# EAGLE design pureDuino (EAGLE 6.5.0)
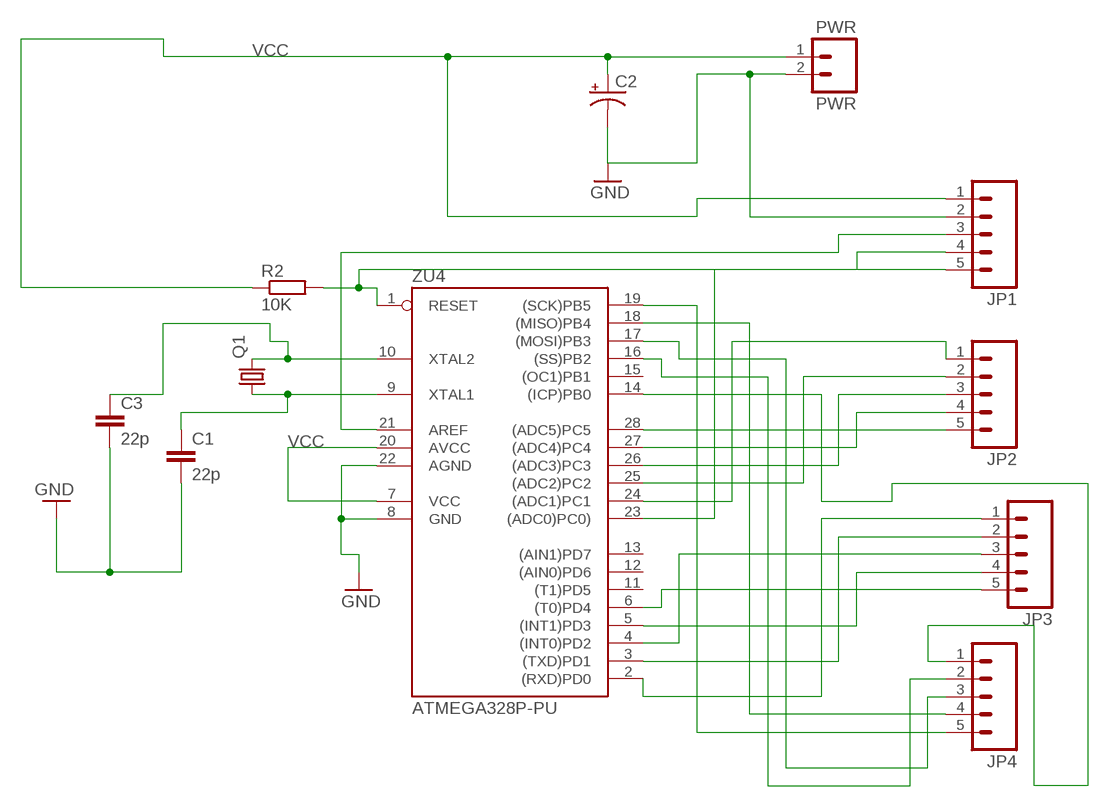
[diagram p0: schematic, sheet 1]

## Parts
C1  22p  C-EU050-025X075  [C050-025X075]
C2  CAP_POLPTH1  [CPOL-RADIAL-100UF-25V]
C3  22p  C-EU050-025X075  [C050-025X075]
JP1  M05PTH  [1X05]
JP2  M05PTH  [1X05]
JP3  M05PTH  [1X05]
JP4  M05PTH  [1X05]
PWR  PWR  M02PTH  [1X02]
Q1  CRYSTALHC49S  [HC49/S]
R2  10K  R-EU_0207/7  [0207/7]
ZU4  ATMEGA328P-PU  [DIL28-3]

## Nets
GND [gnd]: C1.2 C2.2(-) C3.2 JP1.2 PWR.2 ZU4.8(GND) ZU4.22(AGND)
N$1: JP1.3 ZU4.21(AREF)
N$2: JP1.5 ZU4.23((ADC0)PC0))
N$3: JP1.4 R2.2 ZU4.1(RESET)
N$4: C1.1 Q1.1 ZU4.9(XTAL1)
N$5: JP2.1 ZU4.24((ADC1)PC1)
N$6: JP2.2 ZU4.25((ADC2)PC2)
N$7: JP2.3 ZU4.26((ADC3)PC3)
N$8: JP2.4 ZU4.27((ADC4)PC4)
N$9: JP2.5 ZU4.28((ADC5)PC5)
N$10: JP4.5 ZU4.19((SCK)PB5)
N$11: JP3.1 ZU4.2((RXD)PD0)
N$12: JP3.2 ZU4.3((TXD)PD1)
N$13: JP3.3 ZU4.4((INT0)PD2)
N$14: JP3.4 ZU4.5((INT1)PD3)
N$15: JP3.5 ZU4.6((T0)PD4)
N$16: JP4.4 ZU4.18((MISO)PB4)
N$17: JP4.3 ZU4.17((MOSI)PB3)
N$18: JP4.2 ZU4.16((SS)PB2)
N$19: JP4.1 ZU4.14((ICP)PB0)
VCC [usbvcc]: C2.1(+) JP1.1 PWR.1 R2.1 ZU4.7(VCC) ZU4.20(AVCC)
XTAL2: C3.1 Q1.2 ZU4.10(XTAL2)
Unconnected: ZU4.11((T1)PD5) ZU4.12((AIN0)PD6) ZU4.13((AIN1)PD7) ZU4.15((OC1)PB1)

## Library data of the parts
C1 C3 = resistor:C-EU: CAPACITOR, European symbol
C2 = SparkFun-Passives:CAP_POL: Capacitor Polarized These are standard SMD and PTH capacitors. Normally 10uF, 47uF, and 100uF in electrolytic and tantalum varieties. Always verify the external diameter of the through hole cap, it varies with capacity, voltage, and manufacturer. The EIA devices should be standard.
JP1-JP4 = SparkFun-Connectors:M05: Header 5 Standard 5-pin 0.1" header. Use with straight break away headers (SKU : PRT-00116), right angle break away headers (PRT-00553), swiss pins (PRT-00743), machine pins (PRT-00117), and female headers (PRT-00115). Molex polarized connector foot print use with SKU : PRT-08230 with associated crimp pins and housings.
PWR = SparkFun-Connectors:M02: Standard 2-pin 0.1" header. Use with - straight break away headers ( PRT-00116) - right angle break away headers (PRT-00553) - swiss pins (PRT-00743) - machine pins (PRT-00117) - female headers (PRT-00115) Molex polarized connector foot print use with: PRT-08233 with associated crimp pins and housings. 2.54_SCREWTERM for use with PRT-10571. 3.5mm Screw Terminal footprints for PRT-08084 5mm Screw Terminal footprints for use with PRT-08433
Q1 = crystal:CRYSTAL: CRYSTAL; OC_FARNELL: 1667008; OC_NEWARK: unknown
R2 = resistor:R-EU_: RESISTOR, European symbol
ZU4 = SmartPrj:ATMEGA328P-: MICROCONTROLLER 4 Kbytes FLASH 128 bytes SRAM 256 bytes EEPROM UART 6-channel 10 bit ADC

## Net classes
0 default: width 0.152 mm, clearance 0.152 mm
1 power: width 0.61 mm, drill 0.61 mm, clearance 0.254 mm
2 gnd: width 0.203 mm, drill 0.559 mm, clearance 0.152 mm
3 usbvcc: width 0.203 mm, drill 0.61 mm, clearance 0.152 mm
4 aref: width 0.406 mm, drill 0.61 mm, clearance 0.254 mm

## Board
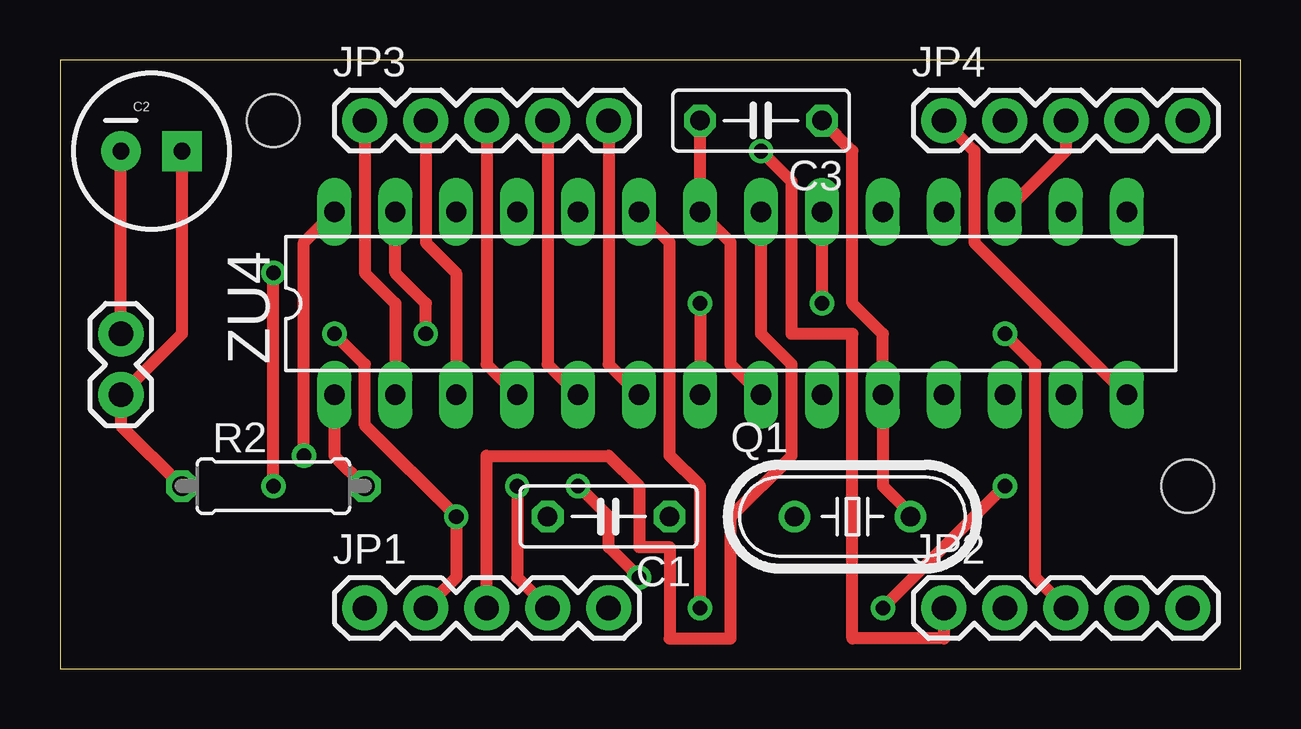
[diagram p1: board, top side]
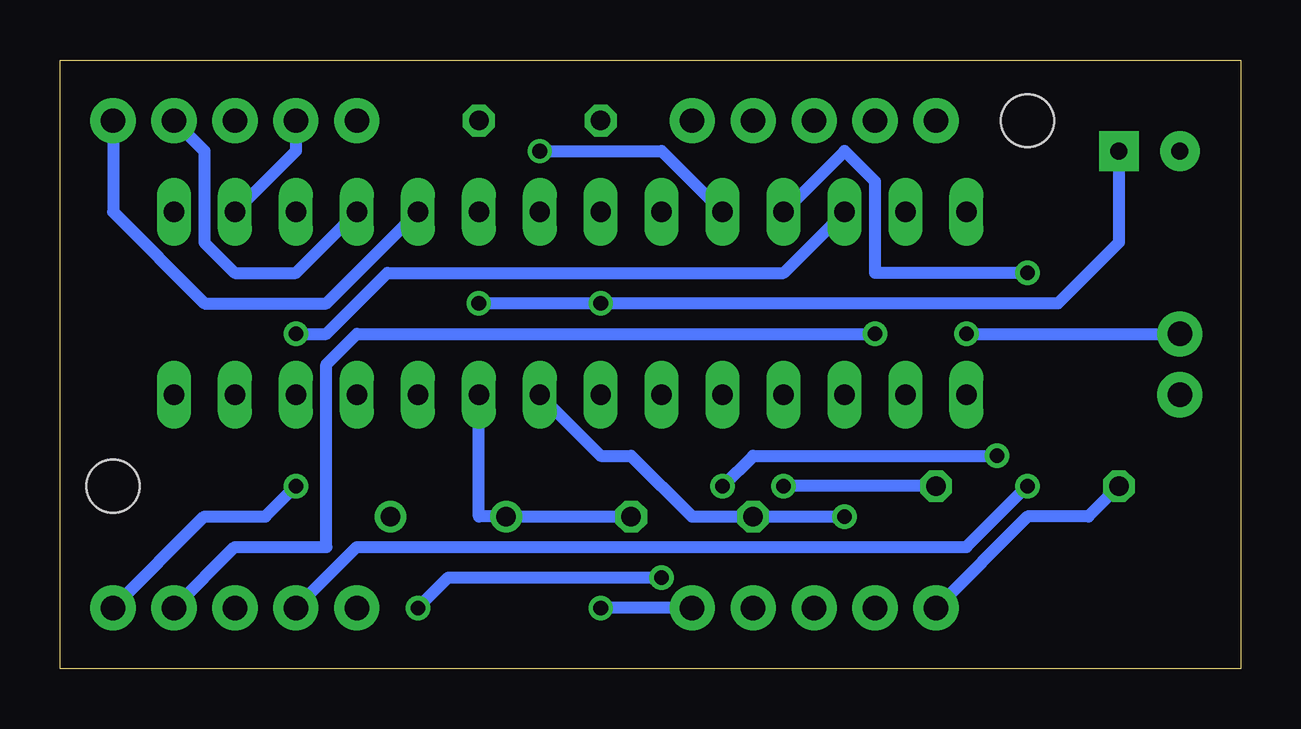
[diagram p2: board, bottom side, seen from below]

Size 49.2 x 25.39 mm. Coordinates in mm from the lower left corner, seen from the top.
Outline: 0,0 49.2,0 49.2,25.39 0,25.39 0,0
Copper layers (1*16): Top 0.035mm / dielectric 1.5mm / Bottom 0.035mm
Design rules "default *": minimum track width 20mil, minimum drill 24mil, track to track 10mil, track to pad 10mil, pad to pad 10mil, via to via 10mil, smd to smd 8mil, copper to edge 40mil, drill to drill 8mil, minimum pad ring 10mil, minimum via ring 8mil, stop-mask expansion 4mil, vias tented up to drill 0mil, thermal gap 10mil
Holes 2.2 mm at 8.89,22.86 46.99,7.62

### Footprints (pad centres in the part's own frame; a part is rotated, then mirrored left to right if it is on the bottom)
C050-025X075 = drill 0.813 octagon: 1 -2.54,0; 2 2.54,0
CPOL-RADIAL-100UF-25V = drill 0.7 pad 1.651 square: 1 1.27,0 | drill 0.7 pad 1.651: 2 -1.27,0
1X05 = drill 1.016 pad 1.88: 1 0,0; 2 2.54,0; 3 5.08,0; 4 7.62,0; 5 10.16,0
1X02 = drill 1.016 pad 1.88: 1 0,0; 2 2.54,0
HC49/S = drill 0.813: 1 -2.413,0; 2 2.413,0
0207/7 = drill 0.813 octagon: 1 -3.81,0; 2 3.81,0
DIL28-3 = drill 0.85 pad 1.422 long: 1 -16.51,-3.81; 2 -13.97,-3.81; 3 -11.43,-3.81; 4 -8.89,-3.81; 5 -6.35,-3.81; 6 -3.81,-3.81; 7 -1.27,-3.81; 8 1.27,-3.81; 9 3.81,-3.81; 10 6.35,-3.81; 11 8.89,-3.81; 12 11.43,-3.81; 13 13.97,-3.81; 14 16.51,-3.81; 15 16.51,3.81; 16 13.97,3.81; 17 11.43,3.81; 18 8.89,3.81; 19 6.35,3.81; 20 3.81,3.81; 21 1.27,3.81; 22 -1.27,3.81; 23 -3.81,3.81; 24 -6.35,3.81; 25 -8.89,3.81; 26 -11.43,3.81; 27 -13.97,3.81; 28 -16.51,3.81

### Placement (x,y rotation side)
C1  22.86,6.35 180 top
C2  3.81,21.59 0 top
C3  29.21,22.86 180 top
JP1  12.7,2.54 0 top
JP2  36.83,2.54 0 top
JP3  12.7,22.86 0 top
JP4  36.83,22.86 0 top
PWR  2.54,11.43 90 top
Q1  33.02,6.35 0 top
R2  8.89,7.62 0 top
ZU4  27.94,15.24 0 top

### Tracks (layer width: path | path; a pad name or v marks a point on that pad's centre or on a via)
GND  (via drill 0.61)
  Top 0.508: PWR.2 C2.2 | C3.2 ZU4.22 27.94,17.78 27.94,12.7 ZU4.8 | JP1.2 16.51,3.81 v16.51,6.35 12.7,10.16 12.7,12.7 v11.43,13.97
  Bottom 0.508: ZU4.8 26.67,8.89 25.4,8.89 22.86,6.35 C1.2 v16.51,6.35 | v11.43,13.97 PWR.2
N$1
  Top 0.508: ZU4.21 29.21,13.97 30.48,12.7 30.48,8.89 27.94,6.35 27.94,1.27 25.4,1.27 25.4,5.08 24.13,5.08 24.13,7.62 22.86,8.89 17.78,8.89 JP1.3
N$2  (via drill 0.61)
  Top 0.508: ZU4.23 25.4,17.78 25.4,8.89 26.67,7.62 v26.67,2.54
  Bottom 0.508: JP1.5 v26.67,2.54
N$3  (via drill 0.61)
  Top 0.508: R2.2 11.43,8.89 ZU4.1 | JP1.4 19.05,3.81 v19.05,7.62
  Bottom 0.508: R2.2 v19.05,7.62
N$4
  Bottom 0.508: C1.1 30.48,6.35 Q1.1 31.75,6.35 ZU4.9
N$5  (via drill 0.61)
  Top 0.508: v29.21,21.59 30.48,20.32 30.48,13.97 33.02,13.97 33.02,1.27 36.83,1.27 JP2.1
  Bottom 0.508: ZU4.24 24.13,21.59 v29.21,21.59
N$6  (via drill 0.61)
  Top 0.508: v8.89,7.62 v8.89,16.51
  Bottom 0.508: ZU4.25 16.51,21.59 15.24,20.32 15.24,16.51 v8.89,16.51 | v8.89,7.62 11.43,5.08 36.83,5.08 JP2.2
N$7  (via drill 0.61)
  Top 0.508: v39.37,13.97 40.64,12.7 40.64,3.81 JP2.3
  Bottom 0.508: ZU4.26 19.05,16.51 35.56,16.51 38.1,13.97 v39.37,13.97
N$8  (via drill 0.61)
  Top 0.508: ZU4.27 13.97,16.51 15.24,15.24 v15.24,13.97
  Bottom 0.508: v15.24,13.97 36.83,13.97 38.1,12.7 38.1,5.08 41.91,5.08 JP2.4
N$9  (via drill 0.61)
  Top 0.508: ZU4.28 10.16,17.78 v10.16,8.89 | v21.59,7.62 22.86,6.35 22.86,5.08 v24.13,3.81 | v39.37,7.62 v34.29,2.54
  Bottom 0.508: v10.16,8.89 20.32,8.89 v21.59,7.62 | v24.13,3.81 33.02,3.81 v34.29,2.54 | v39.37,7.62 40.64,6.35 43.18,6.35 JP2.5
N$10
  Bottom 0.508: ZU4.19 38.1,15.24 43.18,15.24 46.99,19.05 JP4.5
N$11
  Top 0.508: ZU4.2 13.97,15.24 12.7,16.51 JP3.1
N$12
  Top 0.508: ZU4.3 16.51,16.51 15.24,17.78 JP3.2
N$13
  Top 0.508: ZU4.4 17.78,12.7 JP3.3
N$14
  Top 0.508: ZU4.5 20.32,12.7 JP3.4
N$15
  Top 0.508: ZU4.6 22.86,12.7 JP3.5
N$16
  Bottom 0.508: ZU4.18 39.37,16.51 41.91,16.51 43.18,17.78 43.18,21.59 JP4.4
N$17
  Top 0.508: ZU4.17 41.91,21.59 JP4.3
N$18
  Bottom 0.508: ZU4.16 39.37,21.59 JP4.2
N$19
  Top 0.508: ZU4.14 38.1,17.78 38.1,21.59 JP4.1
VCC  (via drill 0.61)
  Top 0.508: R2.1 2.54,10.16 PWR.1 5.08,13.97 C2.1 | v26.67,15.24 ZU4.7 | v31.75,15.24 ZU4.20
  Bottom 0.508: JP1.1 8.89,6.35 6.35,6.35 R2.1 | C2.1 5.08,17.78 7.62,15.24 v26.67,15.24 v31.75,15.24
XTAL2
  Top 0.508: Q1.2 35.56,6.35 34.29,7.62 ZU4.10 34.29,13.97 33.02,15.24 33.02,21.59 C3.1

### Text on the board
tValues: PureDuino / Designed by / Marco Schwartz / February 2014